# Altium project PCB_Project1.PrjPCB
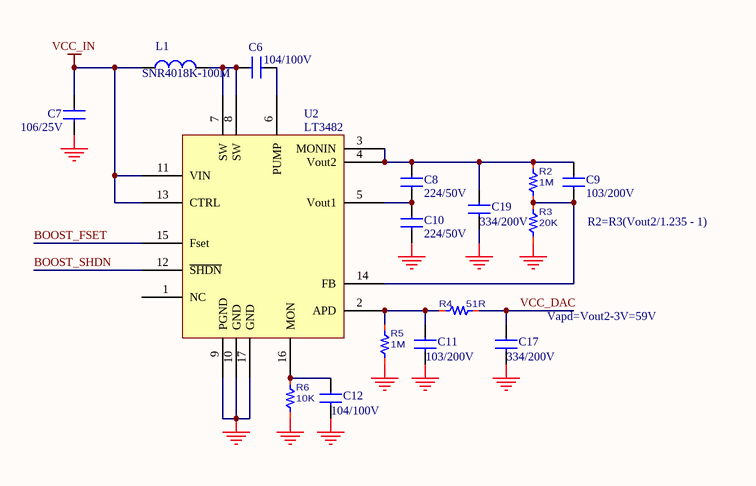
[diagram p0: DC_BOOST_PART.SchDoc]
2 sheets, 24 parts. Net scope: global (net labels, ports and power ports of the same name join across sheets).
Board file: PCB1.PcbDoc
Sheets:
  DC_BOOST_PART.SchDoc
  MCU_PART.SchDoc

## Sheet DC_BOOST_PART.SchDoc
size A4

### Parts
C6  104/100V  [0603C/1]
C7  106/25V  [0603C/1]
C8  224/50V  [0603C/1]
C9  103/200V  [0603C/1]
C10  224/50V  [0603C/1]
C11  103/200V  [0603c/1]
C12  104/100V  [0603c/1]
C17  334/200V  [1210c]
C19  334/200V  [1210c]
L1  SNR4018K-100M  [L3.0-W3.0]
R2  1M  [0603R/1]
R3  20K  [0603R/1]
R4  51R  [0603R/1]
R5  1M  [0603R/1]
R6  10K  [0603R/1]
U2  LT3482  [QFN-16_L3.0-W3.0-P0.50-BL-EP1.7]

### Nets
GND: C7.2 C10.2 C11.2 C12.2 C17.2 C19.2 R3.1 R5.2 R6.1 U2.9(PGND) U2.10(GND) U2.17(GND)
VCC_IN: C7.1 L1.1 U2.11(VIN) U2.13(CTRL)
BOOST_FSET: U2.15(Fset)
BOOST_SHDN: U2.12(~{SHDN})
VCC_DAC: C17.1 R4.1
NetC6_1: C6.1 U2.6(PUMP)
NetC6_2: C6.2 L1.2 U2.7(SW) U2.8(SW)
NetC8_1: C8.1 C9.1 C19.1 R2.2 U2.3(MONIN) U2.4(Vout2)
NetC8_2: C8.2 C10.1 U2.5(Vout1)
NetC9_2: C9.2 R2.1 R3.2 U2.14(FB)
NetC11_1: C11.1 R4.2 R5.1 U2.2(APD)
NetC12_1: C12.1 R6.2 U2.16(MON)

Not connected (* = marked no-connect by the designer): U2 1(NC)

### Notes on the sheet
- (near C9) R2=R3(Vout2/1.235 - 1)
- (near C17) Vapd=Vout2-3V=59V

### Library data of the parts
C6-C12 C17 C19 = 电容: Capacitor
L1 = 电感: Inductor
R2-R6 = RESS1: Resistor

## Sheet MCU_PART.SchDoc
size A4
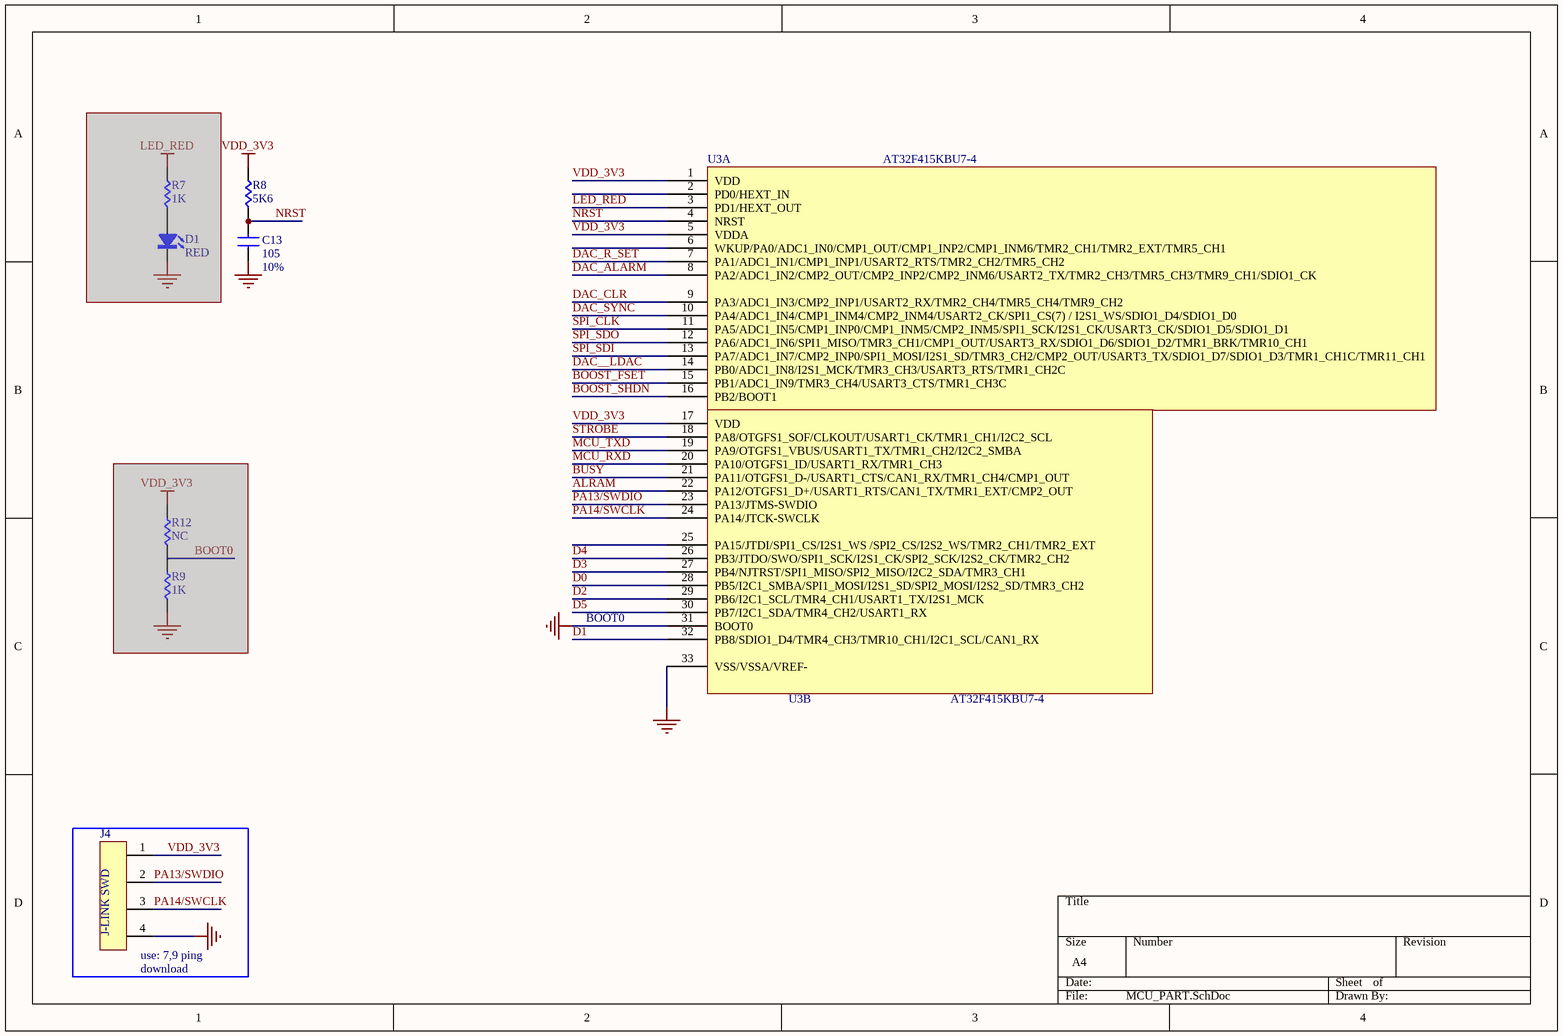
[diagram p1: MCU_PART.SchDoc]

### Parts
C13  105  [0603C/1]
D1  RED  [LED_DIP_2.54]  (masked out: inside a compile mask, not in the netlist)
J4  J-LINK SWD  [HDR-TH_4P-P1.27-V-0.6]
R7  1K  [0603R/1]  (masked out: inside a compile mask, not in the netlist)
R8  5K6  [0603R/1]
R9  1K  [0603R/1]  (masked out: inside a compile mask, not in the netlist)
R12  NC  [0603R/1]  (masked out: inside a compile mask, not in the netlist)
U3  AT32F415KBU7-4  [QFN-32_L4.0-W4.0-P0.40-BL-EP2.7]  (parts A,B of 2)

### Nets
GND: C13.1 J4.4 U3.31(BOOT0) U3.33(VSS/VSSA/VREF-)
VDD_3V3: J4.1 R8.2 U3.1(VDD) U3.5(VDDA) U3.17(VDD)
ALRAM: U3.22(PA12/OTGFS1_D+/USART1_RTS/CAN1_TX/TMR1_EXT/CMP2_OUT)
BOOST_FSET: U3.15(PB1/ADC1_IN9/TMR3_CH4/USART3_CTS/TMR1_CH3C)
BOOST_SHDN: U3.16(PB2/BOOT1)
BUSY: U3.21(PA11/OTGFS1_D-/USART1_CTS/CAN1_RX/TMR1_CH4/CMP1_OUT)
D0: U3.28(PB5/I2C1_SMBA/SPI1_MOSI/I2S1_SD/SPI2_MOSI/I2S2_SD/TMR3_CH2)
D1: U3.32(PB8/SDIO1_D4/TMR4_CH3/TMR10_CH1/I2C1_SCL/CAN1_RX)
D2: U3.29(PB6/I2C1_SCL/TMR4_CH1/USART1_TX/I2S1_MCK)
D3: U3.27(PB4/NJTRST/SPI1_MISO/SPI2_MISO/I2C2_SDA/TMR3_CH1)
D4: U3.26(PB3/JTDO/SWO/SPI1_SCK/I2S1_CK/SPI2_SCK/I2S2_CK/TMR2_CH2)
D5: U3.30(PB7/I2C1_SDA/TMR4_CH2/USART1_RX)
DAC__LDAC: U3.14(PB0/ADC1_IN8/I2S1_MCK/TMR3_CH3/USART3_RTS/TMR1_CH2C)
DAC_ALARM: U3.8(PA2/ADC1_IN2/CMP2_OUT/CMP2_INP2/CMP2_INM6/USART2_TX/TMR2_CH3/TMR5_CH3/TMR9_CH1/SDIO1_CK)
DAC_CLR: U3.9(PA3/ADC1_IN3/CMP2_INP1/USART2_RX/TMR2_CH4/TMR5_CH4/TMR9_CH2)
DAC_R_SET: U3.7(PA1/ADC1_IN1/CMP1_INP1/USART2_RTS/TMR2_CH2/TMR5_CH2)
DAC_SYNC: U3.10(PA4/ADC1_IN4/CMP1_INM4/CMP2_INM4/USART2_CK/SPI1_CS(7)_/_I2S1_WS/SDIO1_D4/SDIO1_D0)
LED_RED: U3.3(PD1/HEXT_OUT)
MCU_RXD: U3.20(PA10/OTGFS1_ID/USART1_RX/TMR1_CH3)
MCU_TXD: U3.19(PA9/OTGFS1_VBUS/USART1_TX/TMR1_CH2/I2C2_SMBA)
NRST: C13.2 R8.1 U3.4(NRST)
PA13/SWDIO: J4.2 U3.23(PA13/JTMS-SWDIO)
PA14/SWCLK: J4.3 U3.24(PA14/JTCK-SWCLK)
SPI_CLK: U3.11(PA5/ADC1_IN5/CMP1_INP0/CMP1_INM5/CMP2_INM5/SPI1_SCK/I2S1_CK/USART3_CK/SDIO1_D5/SDIO1_D1)
SPI_SDI: U3.13(PA7/ADC1_IN7/CMP2_INP0/SPI1_MOSI/I2S1_SD/TMR3_CH2/CMP2_OUT/USART3_TX/SDIO1_D7/SDIO1_D3/TMR1_CH1C/TMR11_CH1)
SPI_SDO: U3.12(PA6/ADC1_IN6/SPI1_MISO/TMR3_CH1/CMP1_OUT/USART3_RX/SDIO1_D6/SDIO1_D2/TMR1_BRK/TMR10_CH1)
STROBE: U3.18(PA8/OTGFS1_SOF/CLKOUT/USART1_CK/TMR1_CH1/I2C2_SCL)

Not connected (* = marked no-connect by the designer): U3 2(PD0/HEXT_IN) 6(WKUP/PA0/ADC1_IN0/CMP1_OUT/CMP1_INP2/CMP1_INM6/TMR2_CH1/TMR2_EXT/TMR5_CH1) 25(PA15/JTDI/SPI1_CS/I2S1_WS_/SPI2_CS/I2S2_WS/TMR2_CH1/TMR2_EXT)

### Notes on the sheet
- BOOT0
- (near J4) download
- (near J4) use: 7,9 ping
- (in symbol 电容) 10%

### Library data of the parts
C13 = 电容: Capacitor
D1 = LED
J4 = CON4: SOCKET
R7-R9 R12 = RES_4G
U3 = AT32F415KBU7

## Nets that join several sheets
GND: DC_BOOST_PART (12 pins), MCU_PART (C13.1 J4.4 U3.31 U3.33)
BOOST_FSET: DC_BOOST_PART (U2.15), MCU_PART (U3.15)
BOOST_SHDN: DC_BOOST_PART (U2.12), MCU_PART (U3.16)